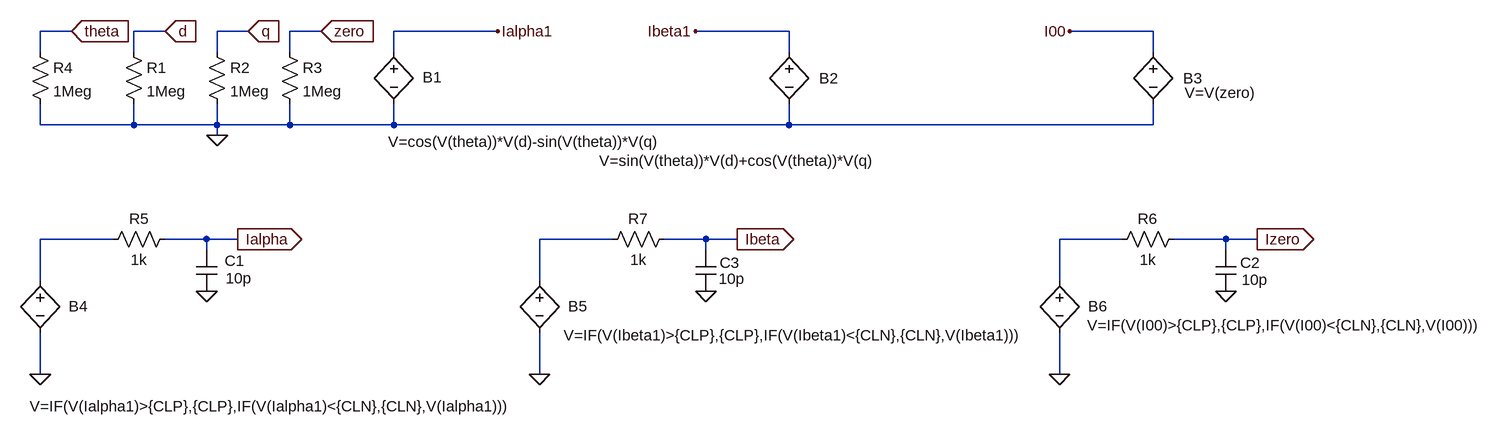
[diagram p0: schematic Inverse_dq_alpha_beta.asc]
Inverse_dq_alpha_beta.asc, the LTspice schematic file:
Version 4.1
SHEET 1 1812 980
WIRE -464 16 -512 16
WIRE -320 16 -368 16
WIRE -192 16 -240 16
WIRE -80 16 -128 16
WIRE 192 16 32 16
WIRE 640 16 496 16
WIRE 1200 16 1072 16
WIRE -512 48 -512 16
WIRE -368 48 -368 16
WIRE -240 48 -240 16
WIRE -128 48 -128 16
WIRE 32 48 32 16
WIRE 640 48 640 16
WIRE 1200 48 1200 16
WIRE -512 160 -512 128
WIRE -368 160 -368 128
WIRE -368 160 -512 160
WIRE -240 160 -240 128
WIRE -240 160 -368 160
WIRE -128 160 -128 128
WIRE -128 160 -240 160
WIRE 32 160 32 128
WIRE 32 160 -128 160
WIRE 640 160 640 128
WIRE 640 160 32 160
WIRE 1200 160 1200 128
WIRE 1200 160 640 160
WIRE -240 176 -240 160
WIRE -400 336 -512 336
WIRE -256 336 -320 336
WIRE -208 336 -256 336
WIRE 368 336 256 336
WIRE 512 336 448 336
WIRE 560 336 512 336
WIRE 1152 336 1056 336
WIRE 1312 336 1232 336
WIRE 1360 336 1312 336
WIRE -256 352 -256 336
WIRE 512 352 512 336
WIRE 1312 352 1312 336
WIRE -512 400 -512 336
WIRE 256 400 256 336
WIRE 1056 400 1056 336
WIRE -512 544 -512 480
WIRE 256 544 256 480
WIRE 1056 544 1056 480
FLAG -240 176 0
FLAG -320 16 d
IOPIN -320 16 In
FLAG -192 16 q
IOPIN -192 16 In
FLAG -80 16 zero
IOPIN -80 16 In
FLAG 192 16 Ialpha1
FLAG 496 16 Ibeta1
FLAG 1072 16 I00
FLAG -464 16 theta
IOPIN -464 16 In
FLAG -208 336 Ialpha
IOPIN -208 336 Out
FLAG -512 544 0
FLAG 560 336 Ibeta
IOPIN 560 336 Out
FLAG 256 544 0
FLAG 1360 336 Izero
IOPIN 1360 336 Out
FLAG 1056 544 0
FLAG -256 416 0
FLAG 1312 416 0
FLAG 512 416 0
SYMBOL res -384 32 R0
SYMATTR InstName R1
SYMATTR Value 1Meg
SYMBOL res -256 32 R0
SYMATTR InstName R2
SYMATTR Value 1Meg
SYMBOL res -144 32 R0
SYMATTR InstName R3
SYMATTR Value 1Meg
SYMBOL bv 32 32 R0
WINDOW 0 44 55 Left 2
WINDOW 3 -9 154 Left 2
SYMATTR InstName B1
SYMATTR Value V=cos(V(theta))*V(d)-sin(V(theta))*V(q)
SYMBOL bv 640 32 R0
WINDOW 0 46 56 Left 2
WINDOW 3 -292 183 Left 2
SYMATTR InstName B2
SYMATTR Value V=sin(V(theta))*V(d)+cos(V(theta))*V(q)
SYMBOL res -528 32 R0
SYMATTR InstName R4
SYMATTR Value 1Meg
SYMBOL bv 1200 32 R0
WINDOW 0 46 56 Left 2
WINDOW 3 49 79 Left 2
SYMATTR InstName B3
SYMATTR Value V=V(zero)
SYMBOL bv -512 384 R0
WINDOW 0 44 55 Left 2
WINDOW 3 -16 209 Left 2
SYMATTR InstName B4
SYMATTR Value V=IF(V(Ialpha1)>{CLP},{CLP},IF(V(Ialpha1)<{CLN},{CLN},V(Ialpha1)))
SYMBOL bv 256 384 R0
WINDOW 0 44 55 Left 2
WINDOW 3 37 100 Left 2
SYMATTR InstName B5
SYMATTR Value V=IF(V(Ibeta1)>{CLP},{CLP},IF(V(Ibeta1)<{CLN},{CLN},V(Ibeta1)))
SYMBOL bv 1056 384 R0
WINDOW 0 44 55 Left 2
WINDOW 3 43 84 Left 2
SYMATTR InstName B6
SYMATTR Value V=IF(V(I00)>{CLP},{CLP},IF(V(I00)<{CLN},{CLN},V(I00)))
SYMBOL res -304 320 R90
WINDOW 0 0 56 VBottom 2
WINDOW 3 32 56 VTop 2
SYMATTR InstName R5
SYMATTR Value 1k
SYMBOL res 1248 320 R90
WINDOW 0 0 56 VBottom 2
WINDOW 3 32 56 VTop 2
SYMATTR InstName R6
SYMATTR Value 1k
SYMBOL res 464 320 R90
WINDOW 0 0 56 VBottom 2
WINDOW 3 32 56 VTop 2
SYMATTR InstName R7
SYMATTR Value 1k
SYMBOL cap -272 352 R0
WINDOW 0 44 17 Left 2
WINDOW 3 45 44 Left 2
SYMATTR InstName C1
SYMATTR Value 10p
SYMBOL cap 1296 352 R0
WINDOW 0 38 20 Left 2
WINDOW 3 40 46 Left 2
SYMATTR InstName C2
SYMATTR Value 10p
SYMBOL cap 496 352 R0
WINDOW 0 37 20 Left 2
WINDOW 3 36 45 Left 2
SYMATTR InstName C3
SYMATTR Value 10p

The netlist it stands for:
* Inverse_dq_alpha_beta.asc
R1 d 0 1Meg
R2 q 0 1Meg
R3 zero 0 1Meg
B1 Ialpha1 0 V=cos(V(theta))*V(d)-sin(V(theta))*V(q)
B2 Ibeta1 0 V=sin(V(theta))*V(d)+cos(V(theta))*V(q)
R4 theta 0 1Meg
B3 I00 0 V=V(zero)
B4 N001 0 V=IF(V(Ialpha1)>{CLP},{CLP},IF(V(Ialpha1)<{CLN},{CLN},V(Ialpha1)))
B5 N002 0 V=IF(V(Ibeta1)>{CLP},{CLP},IF(V(Ibeta1)<{CLN},{CLN},V(Ibeta1)))
B6 N003 0 V=IF(V(I00)>{CLP},{CLP},IF(V(I00)<{CLN},{CLN},V(I00)))
R5 Ialpha N001 1k
R6 Izero N003 1k
R7 Ibeta N002 1k
C1 Ialpha 0 10p
C2 Izero 0 10p
C3 Ibeta 0 10p
.backanno
.end